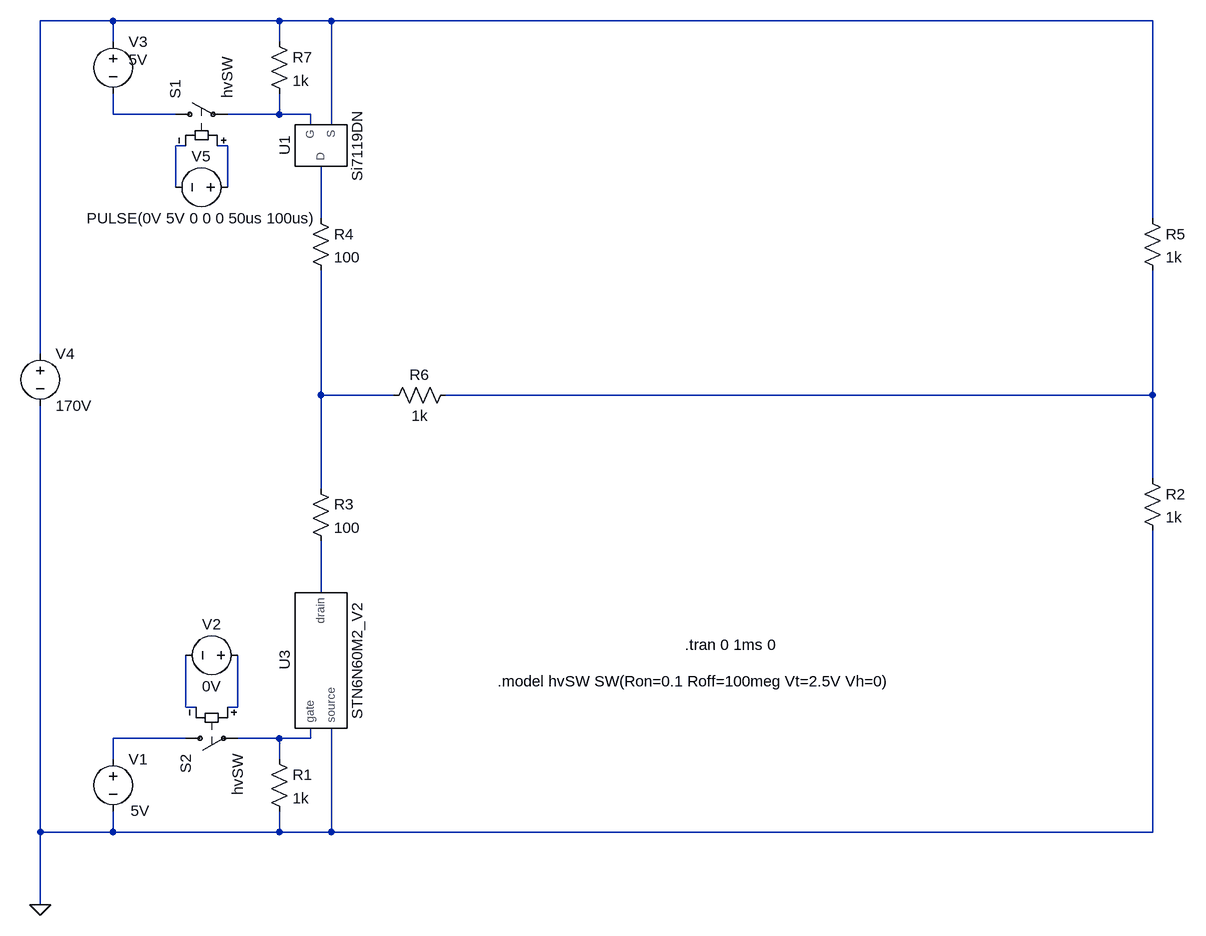
[diagram p0: schematic Output MOSFET Test.asc]
Output MOSFET Test.asc, the LTspice schematic file:
Version 4
SHEET 1 2672 884
WIRE -688 -496 -800 -496
WIRE -432 -496 -688 -496
WIRE -352 -496 -432 -496
WIRE 912 -496 -352 -496
WIRE -688 -464 -688 -496
WIRE -432 -464 -432 -496
WIRE -688 -352 -688 -384
WIRE -592 -352 -688 -352
WIRE -432 -352 -432 -384
WIRE -432 -352 -512 -352
WIRE -384 -352 -432 -352
WIRE -384 -336 -384 -352
WIRE -352 -336 -352 -496
WIRE -576 -304 -592 -304
WIRE -512 -304 -528 -304
WIRE -592 -240 -592 -304
WIRE -512 -240 -512 -304
WIRE -368 -192 -368 -272
WIRE 912 -192 912 -496
WIRE -800 16 -800 -496
WIRE -368 80 -368 -112
WIRE -256 80 -368 80
WIRE 912 80 912 -112
WIRE 912 80 -176 80
WIRE 912 208 912 80
WIRE -368 224 -368 80
WIRE -368 384 -368 304
WIRE -576 560 -576 480
WIRE -560 560 -576 560
WIRE -496 560 -496 480
WIRE -496 560 -512 560
WIRE -576 608 -688 608
WIRE -432 608 -496 608
WIRE -384 608 -384 592
WIRE -384 608 -432 608
WIRE -688 640 -688 608
WIRE -432 640 -432 608
WIRE -800 752 -800 96
WIRE -688 752 -688 720
WIRE -688 752 -800 752
WIRE -432 752 -432 720
WIRE -432 752 -688 752
WIRE -352 752 -352 592
WIRE -352 752 -432 752
WIRE 912 752 912 288
WIRE 912 752 -352 752
WIRE -800 864 -800 752
FLAG -800 864 0
SYMBOL voltage -688 624 R0
WINDOW 123 0 0 Left 0
WINDOW 39 0 0 Left 0
WINDOW 3 27 95 Left 2
SYMATTR Value 5V
SYMATTR InstName V1
SYMBOL res -160 64 R90
WINDOW 0 0 56 VBottom 2
WINDOW 3 32 56 VTop 2
SYMATTR InstName R6
SYMATTR Value 1k
SYMBOL voltage -800 0 R0
WINDOW 123 0 0 Left 0
WINDOW 39 0 0 Left 0
SYMATTR InstName V4
SYMATTR Value 170V
SYMBOL AutoGenerated\\Si7119DN -368 -304 R270
SYMATTR InstName U1
SYMBOL AutoGenerated\\STN6N60M2_V2 -368 480 M90
SYMATTR InstName U3
SYMBOL voltage -688 -480 R0
WINDOW 123 0 0 Left 0
WINDOW 39 0 0 Left 0
WINDOW 3 24 44 Left 2
SYMATTR InstName V3
SYMATTR Value 5V
SYMBOL res 896 192 R0
SYMATTR InstName R2
SYMATTR Value 1k
SYMBOL res -384 208 R0
SYMATTR InstName R3
SYMATTR Value 100
SYMBOL res -384 -208 R0
SYMATTR InstName R4
SYMATTR Value 100
SYMBOL res 896 -208 R0
SYMATTR InstName R5
SYMATTR Value 1k
SYMBOL sw -608 -352 R270
SYMATTR InstName S1
SYMATTR Value hvSW
SYMBOL sw -592 608 M90
SYMATTR InstName S2
SYMATTR Value hvSW
SYMBOL res -448 624 R0
SYMATTR InstName R1
SYMATTR Value 1k
SYMBOL res -448 -480 R0
SYMATTR InstName R7
SYMATTR Value 1k
SYMBOL voltage -480 480 R90
WINDOW 0 -32 56 VBottom 2
WINDOW 3 32 56 VTop 2
WINDOW 123 0 0 Left 0
WINDOW 39 0 0 Left 0
SYMATTR InstName V2
SYMATTR Value 0V
SYMBOL voltage -496 -240 R90
WINDOW 0 -32 56 VBottom 2
WINDOW 3 32 56 VTop 2
WINDOW 123 0 0 Left 0
WINDOW 39 0 0 Left 0
SYMATTR InstName V5
SYMATTR Value PULSE(0V 5V 0 0 0 50us 100us)
TEXT 192 464 Left 2 !.tran 0 1ms 0
TEXT -96 520 Left 2 !.model hvSW SW(Ron=0.1 Roff=100meg Vt=2.5V Vh=0)

The netlist it stands for:
* Output MOSFET Test.asc
V1 N012 0 5V
R6 N008 N007 1k
V4 N001 0 170V
XU1 N006 N003 N001 Si7119DN  ; pins D G S
XU3 N009 N013 0 STN6N60M2_V2  ; pins drain gate source
V3 N001 N002 5V
R2 N008 0 1k
R3 N007 N009 100
R4 N006 N007 100
R5 N001 N008 1k
S1 N002 N003 N005 N004 hvSW
S2 N012 N013 N011 N010 hvSW
R1 N013 0 1k
R7 N001 N003 1k
V2 N011 N010 0V
V5 N005 N004 PULSE(0V 5V 0 0 0 50us 100us)
.tran 0 1ms 0
.model hvSW SW(Ron=0.1 Roff=100meg Vt=2.5V Vh=0)
.lib Z:\media\Daten\Projekte\ELController\ltspice model\si7119dn\si7119dn_ps.lib
.lib D:\Projekte\ELController\ltspice model\en.stn6n60m2_spice\STN6N60M2_V2.LIB
.backanno
.end